# EAGLE design slush_cap_board_rev_b (EAGLE 8.5.0)
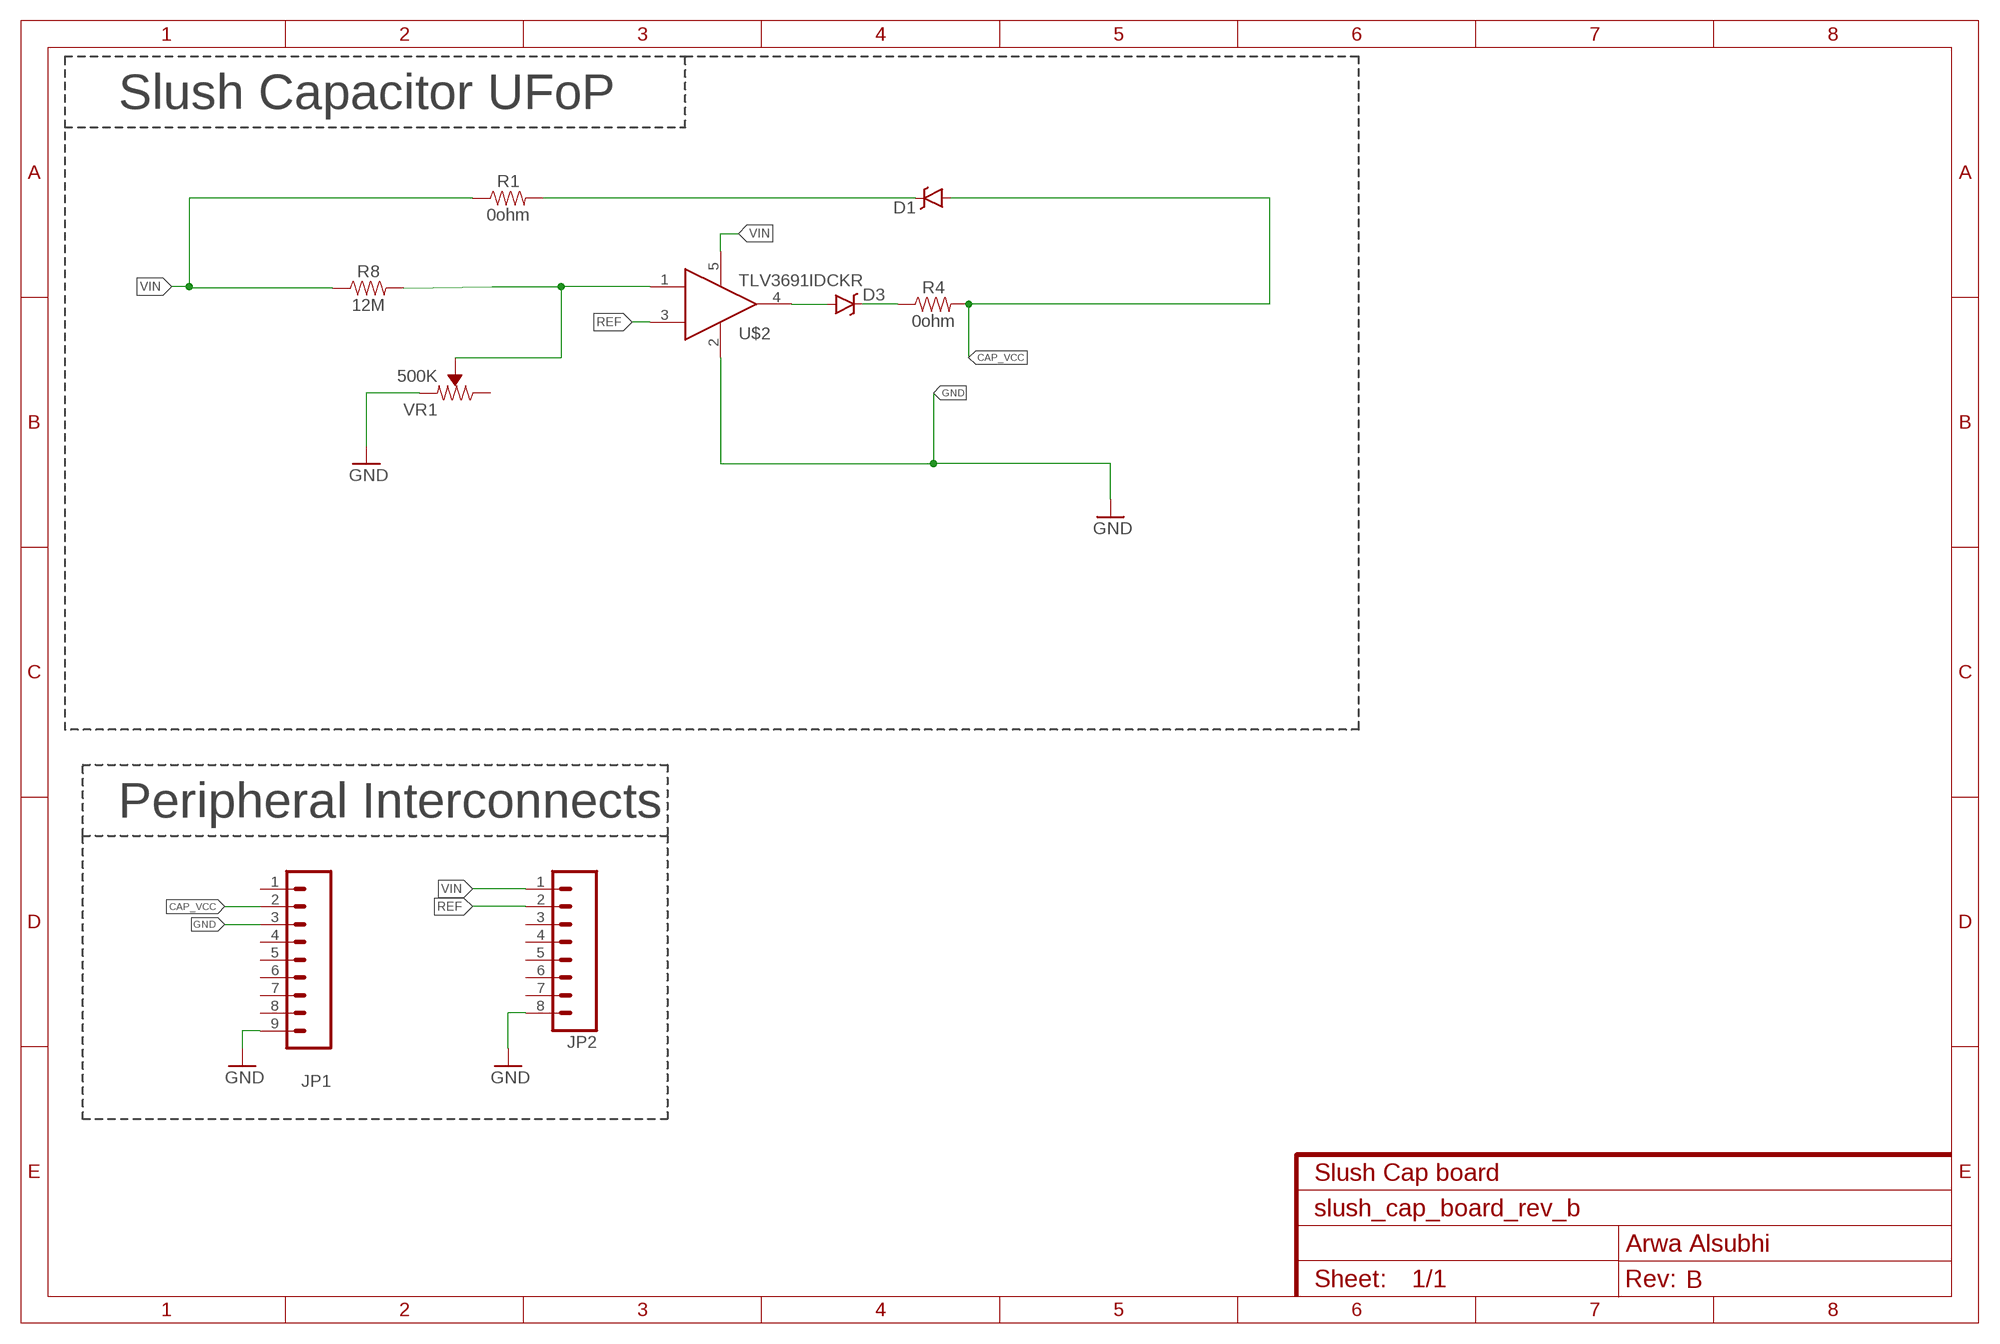
[diagram p0: schematic, sheet 1]
FRAME2 (FRAME-A4L): CNAME: Slush Cap board; CREVISION: B; DESIGNER: Arwa Alsubhi

## Parts
D1  RB751  DIODE-SCHOTTKY-RB751  [SOD-523]
D3  RB751  DIODE-SCHOTTKY-RB751  [SOD-523]
JP1  M091.27MM  [1X09-1.27MM]
JP2  M081.27MM  [1X08-1.27MM]
R1  0ohm  0603-RESISTOR-0603-1/10W-1%  [0603]
R4  0ohm  0603-RESISTOR-0603-1/10W-1%  [0603]
R8  12M  0.3OHM-0805-1/8W-1%  [0805]
U$2  TLV3691IDCKR  [SOT353]
VR1  500K  TRIMPOT-SMD-3MM-CLOSED-1/8W-20%  [TRIMPOT-SMD-3MM-CLOSED]

## Nets
CAP_VCC: D1.A JP1.2 R4.2
GND: JP1.3 JP1.9 JP2.8 U$2.2 VR1.1(CCW)
N$1: D3.A U$2.4
N$4: R8.2 U$2.1 VR1.2(WIPER)
N$6: D1.C R1.2
N$7: D3.C R4.1
REF: JP2.2 U$2.3
VIN: JP2.1 R1.1 R8.1 U$2.5
Unconnected: JP1.1 JP1.4 JP1.5 JP1.6 JP1.7 JP1.8 JP2.3 JP2.4 JP2.5 JP2.6 JP2.7 VR1.3(CW)

## Notes on the sheet
- Slush Capacitor UFoP
- Peripheral Interconnects

## Library data of the parts
D1 D3 = SparkFun-DiscreteSemi:DIODE-SCHOTTKY: Schottky diodes in SFE's production catalog BAT20J 1A 23V 0.62Vf RB751 120mA 40V 0.37Vf PMEG4005EJ 0.5A 40V 0.42Vf MBRA140 1A 40V 0.5Vf B340A 3A 40V SMA; DIGIKEY: BAS40-02V-V-G-08GICT-ND; MPN: BAS40-02V-V-G-08; PROD_ID: DIO-11018
JP1 = SparkFun-Connectors:M09: Header 9 Standard 9-pin 0.1" header. Use with straight break away headers (SKU : PRT-00116), right angle break away headers (PRT-00553), swiss pins (PRT-00743), machine pins (PRT-00117), and female headers (PRT-00115).; DIGIKEY: S9014E-09-ND; MANUFACTURERPARTNUMBER: GRPB091VWVN-RC; MPN: GRPB091VWVN-RC
JP2 = SparkFun-Connectors:M08: Header 8 Standard 8-pin 0.1" header. Use with straight break away headers (SKU : PRT-00116), right angle break away headers (PRT-00553), swiss pins (PRT-00743), machine pins (PRT-00117), and female headers (PRT-00115).; DIGIKEY: S9014E-08-ND; MANUFACTURERPARTNUMBER: GRPB081VWVN-RC; MPN: GRPB081VWVN-RC
R1 R4 = Arwa_lib:0603-RESISTOR: resistor A resistor is a passive two-terminal electrical component that implements electrical resistance as a circuit element. Resistors act to reduce current flow, and, at the same time, act to lower voltage levels within circuits. - Wikipedia; PROD_ID: RES-08787
R8 = SparkFun-Resistors:0.3OHM: 0.3Ω resistor A resistor is a passive two-terminal electrical component that implements electrical resistance as a circuit element. Resistors act to reduce current flow, and, at the same time, act to lower voltage levels within circuits. - Wikipedia; PROD_ID: RES-11622; VALUE: 0.3
U$2 = Arwa_lib:TLV3691IDCKR
VR1 = SparkFun-Resistors:TRIMPOT: Trimming Potentiometer (Trimpot) Three-terminal potentiometers, with an adjustable wiper and two adjustable resistors. A pot can be used to create a configurable voltage divider, or as a variable resistor. "Trimpots" are a subset of potentiometers, usually intended for "set-and-forget" applications. They're often more delicate than standard potentiometers - rated for fewer turns. Variants PTH-KNOB - PTH Trimpot w/ finger-adjustable knob Trimpot 10K with Knob <https://www.sparkfun.com/products/9806> (COM-09806) Datasheet <http://www.sparkfun.com/datasheets/Components/General/TSR-3386.pdf> SMD-3MM-CLOSED-FRAME - SMD 3mm Square Closed-Frame Trimpot Used on e.g. EasyDriver - Stepper Motor Driver <https://www.sparkfun.com/products/12779> Datasheet <http://www.bitechnologies.com/pdfs/22.pdf> (22AR10KTR) SMD-5MM - SMD 5mm Square Closed-Frame Trimpot Used on e.g. IOIO-OTG - V2.2 <https://www.sparkfun.com/products/13613> Datasheet <http://www.vishay.com/docs/51008/ts53.pdf> (TS53YL502MR10) SMD-3MM-1/10W-25% - 3mm Square Open-Frame Trimpot Used on e.g. SparkFun Shapeoko <https://www.sparkfun.com/products/13899> Datasheet <http://www.bourns.com/docs/Product-Datasheets/TC33.pdf> (TC33X-2-103E); PROD_ID: RES-09285; VALUE: 10k

## Board
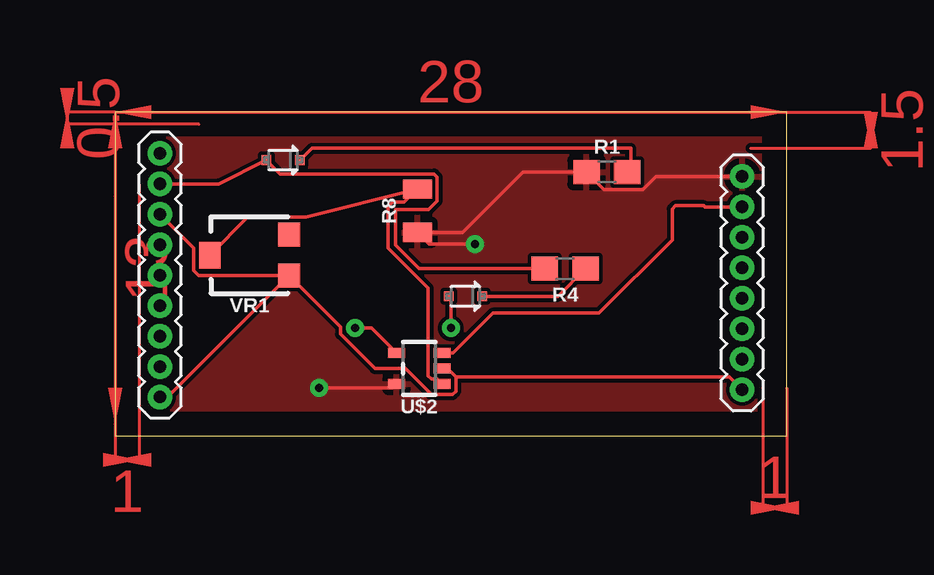
[diagram p1: board, top side]
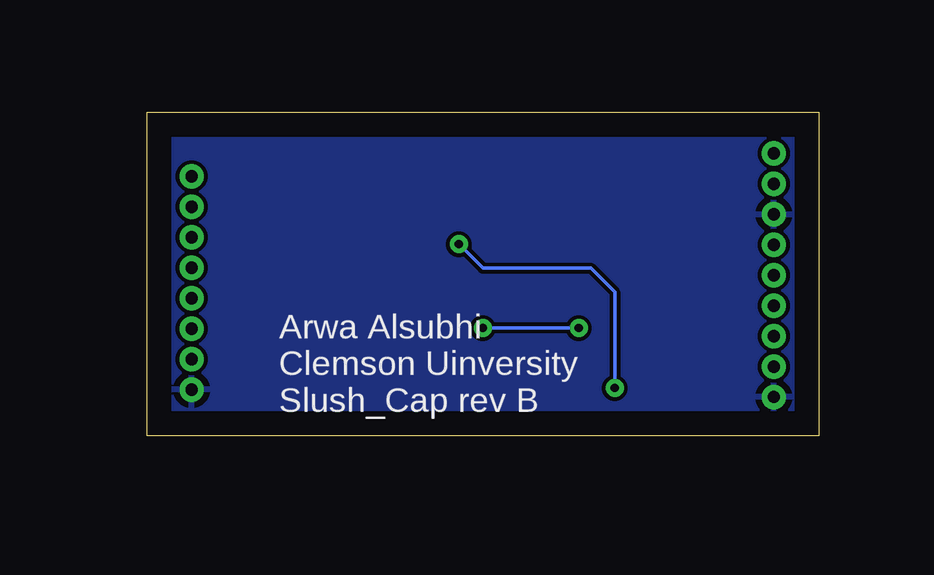
[diagram p2: board, bottom side, seen from below]

Size 28 x 13.5 mm. Coordinates in mm from the lower left corner, seen from the top.
Outline: 0,0 28,0 28,13.5 0,13.5 0,0
Copper layers (1*16): Top 0.035mm / dielectric 1.5mm / Bottom 0.035mm
Design rules "default": minimum track width 6mil, minimum drill 0.35mm, track to track 6mil, track to pad 6mil, pad to pad 6mil, via to via 6mil, smd to smd 6mil, copper to edge 40mil, drill to drill 6mil, minimum pad ring 10mil, minimum via ring 8mil, stop-mask expansion 4mil, vias tented up to drill 0mil, thermal gap 10mil

### Footprints (pad centres in the part's own frame; a part is rotated, then mirrored left to right if it is on the bottom)
SOD-523 = smd 0.4 x 0.4: A -0.7,0; C 0.7,0
1X09-1.27MM = drill 0.508 pad 1: 1 0,0; 2 1.27,0; 3 2.54,0; 4 3.81,0; 5 5.08,0; 6 6.35,0; 7 7.62,0; 8 8.89,0; 9 10.16,0
1X08-1.27MM = drill 0.508 pad 1: 1 0,0; 2 1.27,0; 3 2.54,0; 4 3.81,0; 5 5.08,0; 6 6.35,0; 7 7.62,0; 8 8.89,0
0603 = smd 1.1 x 1: 1 -0.85,0; 2 0.85,0
0805 = smd 0.8 x 1.2: 1 -0.9,0; 2 0.9,0
SOT353 = smd 0.42 x 0.7: 1 -0.65,-0.95; 2 0,-0.95; 3 0.65,-0.95; 4 0.65,0.95; 5 -0.65,0.95
TRIMPOT-SMD-3MM-CLOSED = smd 1 x 0.9: 1 -0.85,-1.65; 3 0.85,-1.65 | smd 1.1 x 0.9: 2 0,1.65

### Placement (x,y rotation side)
D1  7,11.5 0 top
D3  14.6,5.82 0 top
JP1  1.87,11.78 270 top
JP2  26.14,10.82 270 top
R1  20.5,11 0 top
R4  18.76,6.97 180 top
R8  12.6,9.39 90 top
U$2  12.68,2.81 90 top
VR1  5.6,7.54 90 top

### Tracks (layer width: path | path; a pad name or v marks a point on that pad's centre or on a via)
CAP_VCC
  Top 0.152: JP1.2 4.31,10.51 D1.A 6.88,10.92 13.29,10.92 13.43,10.79 13.43,9.79 13.07,9.44 11.68,9.44 11.68,7.96 12.67,6.97 R4.2
GND
  Top 0.152: VR1.1 9.39,4.55 9.39,4.25 10.83,2.81 12.1,2.81 13.19,1.72 14.07,1.72 14.21,1.85 14.21,2.46 | 14.21,2.46 13.86,2.81 U$2.2 | 14.21,2.46 25.61,2.46 JP2.8 | VR1.1 2.18,1.62 JP1.9 | JP1.3 3.27,7.84 3.27,6.89 3.48,6.69 VR1.1
  pour Bottom: 0,14 28,14 28,0 0,0
N$1  (via drill 0.35)
  Top 0.152: U$2.4 10.69,4.5 v10,4.5 | v14,4.5 14,5.72 D3.A
  Bottom 0.152: v10,4.5 v14,4.5
N$4
  Top 0.152: 7.97,9.13 7.93,9.12 5.53,9.12 VR1.2 | 7.97,9.13 R8.2 12.05,9.74 11.55,9.74 11.38,9.56 11.38,7.83 13.05,6.16 13.05,2.5 13.19,2.37 13.42,2.37 U$2.1 | 7.97,9.13
N$6
  Top 0.152: D1.C 8.2,12 21.5,12 21.5,11.15 R1.2
N$7
  Top 0.152: D3.C 18.46,5.82 R4.1
REF
  Top 0.152: U$2.3 14.08,3.46 15.75,5.12 20.17,5.12 23.22,8.18 23.22,9.46 23.36,9.6 24.55,9.6 24.59,9.55 JP2.2
VIN  (via drill 0.35)
  Top 0.152: v15,8 13.09,8 R8.1 14.49,8.49 17,11 R1.1 20.38,10.27 22,10.27 22.54,10.82 JP2.1 | v8.5,2 11.57,2 U$2.5
  Bottom 0.152: v15,8 14,7 9.5,7 8.5,6 v8.5,2
  pour Top: 0,14 28,14 28,-0.5 0,-0.5
(copper drawn outside any net)
  shapes: Top area x6

### Text on the board
bNames: Arwa Alsubhi / Clemson Uinversity / Slush_Cap rev B